# EAGLE schematic cdf-modular-bridge-rev3 (EAGLE 7.3.0)
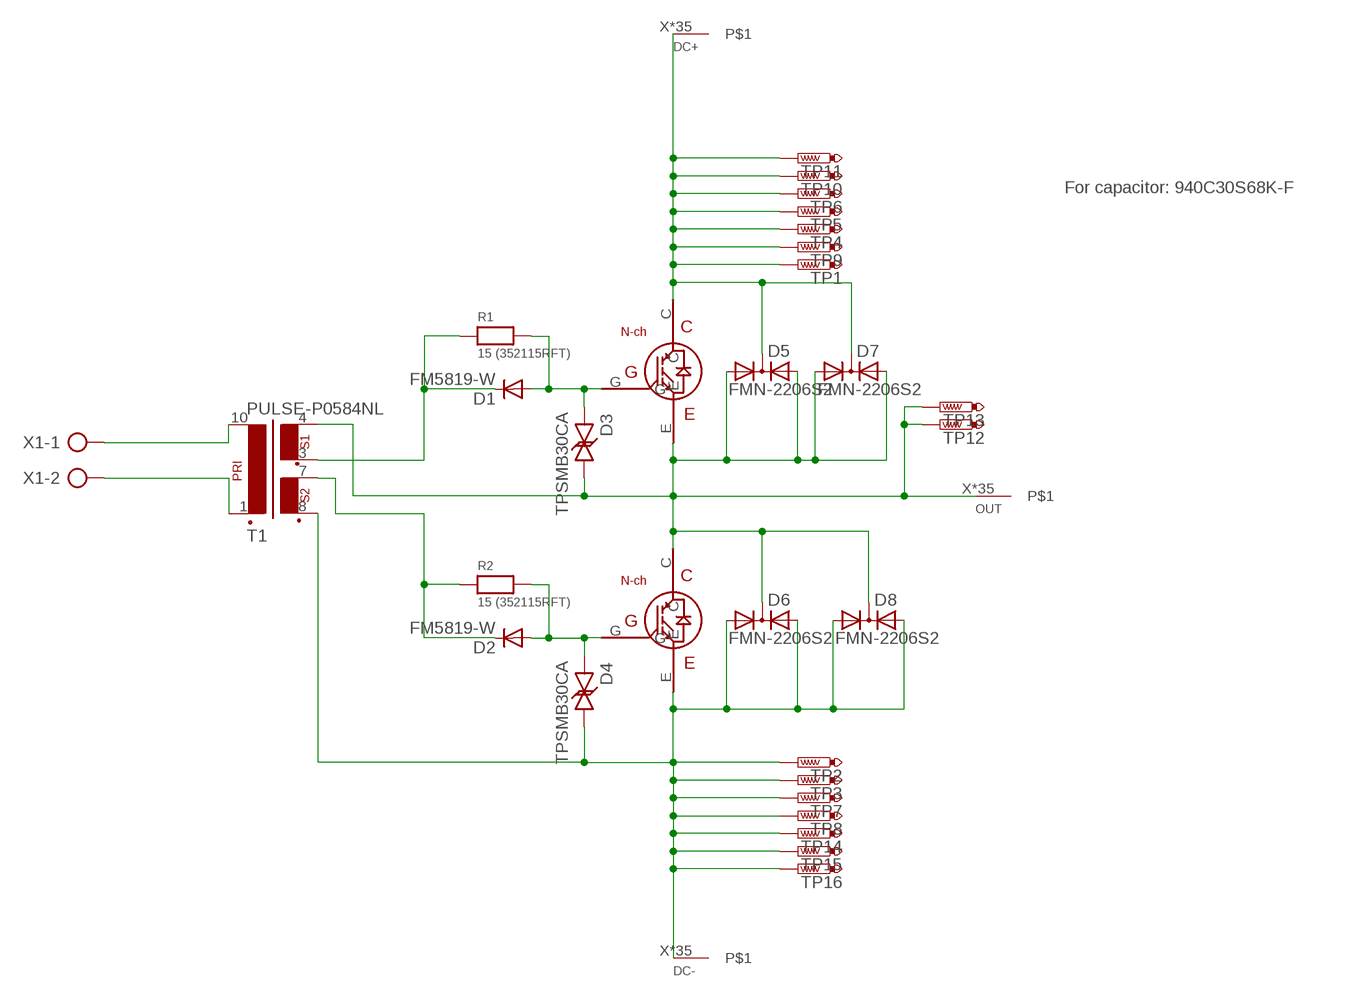
[diagram p0: schematic, sheet 1]

## Parts
D1  FM5819-W  S1A  [DO214AC]
D2  FM5819-W  S1A  [DO214AC]
D3  TPSMB30CA  TPSMB15CA  [TPSMB15CA]
D4  TPSMB30CA  TPSMB15CA  [TPSMB15CA]
D5  FMN-2206S2  [TO220-CDF-SPACED-LEGS]
D6  FMN-2206S2  [TO220-CDF-SPACED-LEGS]
D7  FMN-2206S2  [TO220-CDF-SPACED-LEGS]
D8  FMN-2206S2  [TO220-CDF-SPACED-LEGS]
DC+  BIG-ASS-HOLE  [BIG-ASS-HOLE]
DC-  BIG-ASS-HOLE  [BIG-ASS-HOLE]
OUT  BIG-ASS-HOLE  [BIG-ASS-HOLE]
Q1  Ixgh48n60a3  IXGH40N60A  [IXGH40N60A]
Q2  Ixgh48n60a3  IXGH40N60A  [IXGH40N60A]
R1  15 (352115RFT)  RESISTOR2512  [2512]
R2  15 (352115RFT)  RESISTOR2512  [2512]
T1  PULSE-P0584NL  [PULSE-P0584NL]
TP1  PTR1PAD1-17  [P1-17]
TP2  PTR1PAD1-17  [P1-17]
TP3  PTR1PAD1-17  [P1-17]
TP4  PTR1PAD1-17  [P1-17]
TP5  PTR1PAD1-17  [P1-17]
TP6  PTR1PAD1-17  [P1-17]
TP7  PTR1PAD1-17  [P1-17]
TP8  PTR1PAD1-17  [P1-17]
TP9  PTR1PAD1-17  [P1-17]
TP10  PTR1PAD1-17  [P1-17]
TP11  PTR1PAD1-17  [P1-17]
TP12  PTR1PAD1-17  [P1-17]
TP13  PTR1PAD1-17  [P1-17]
TP14  PTR1PAD1-17  [P1-17]
TP15  PTR1PAD1-17  [P1-17]
TP16  PTR1PAD1-17  [P1-17]
X1  AK500/2  [AK500/2]

## Nets
DC+: D5.C D7.C DC+.X DC+.X@1 DC+.X@2 DC+.X@3 DC+.X@4 DC+.X@5 DC+.X@6 DC+.X@7 DC+.X@8 DC+.X@9 DC+.X@10 DC+.X@11 DC+.X@12 DC+.X@13 DC+.X@14 DC+.X@15 DC+.X@16 DC+.X@17 DC+.X@18 DC+.X@19 DC+.X@20 DC+.X@21 DC+.X@22 DC+.X@23 DC+.X@24 DC+.X@25 DC+.X@26 DC+.X@27 DC+.X@28 DC+.X@29 DC+.X@30 DC+.X@31 DC+.X@32 DC+.X@34 DC+.X@120 Q1.C TP1.TP TP4.TP TP5.TP TP6.TP TP9.TP TP10.TP TP11.TP
DC-: D4.P$2 D6.A1 D6.A2 D8.A1 D8.A2 DC-.X DC-.X@1 DC-.X@2 DC-.X@3 DC-.X@4 DC-.X@5 DC-.X@6 DC-.X@7 DC-.X@8 DC-.X@9 DC-.X@10 DC-.X@11 DC-.X@12 DC-.X@13 DC-.X@14 DC-.X@15 DC-.X@16 DC-.X@17 DC-.X@18 DC-.X@19 DC-.X@20 DC-.X@21 DC-.X@22 DC-.X@23 DC-.X@24 DC-.X@25 DC-.X@26 DC-.X@27 DC-.X@28 DC-.X@29 DC-.X@30 DC-.X@31 DC-.X@32 DC-.X@34 DC-.X@120 Q2.E T1.8(SEC2_POS) TP2.TP TP3.TP TP7.TP TP8.TP TP14.TP TP15.TP TP16.TP
N$1: T1.10(PRI_NEG) X1.1
N$2: T1.1(PRI_POS) X1.2
N$3: D1.A D3.P$1 Q1.G R1.2
N$5: D2.A D4.P$1 Q2.G R2.2
N$7: D2.C R2.1 T1.7(SEC2_NEG)
N$8: D1.C R1.1 T1.3(SEC1_POS)
OUT: D3.P$2 D5.A1 D5.A2 D6.C D7.A1 D7.A2 D8.C OUT.X OUT.X@1 OUT.X@2 OUT.X@3 OUT.X@4 OUT.X@5 OUT.X@6 OUT.X@7 OUT.X@8 OUT.X@9 OUT.X@10 OUT.X@11 OUT.X@12 OUT.X@13 OUT.X@14 OUT.X@15 OUT.X@16 OUT.X@17 OUT.X@18 OUT.X@19 OUT.X@20 OUT.X@21 OUT.X@22 OUT.X@23 OUT.X@24 OUT.X@25 OUT.X@26 OUT.X@27 OUT.X@28 OUT.X@29 OUT.X@30 OUT.X@31 OUT.X@32 OUT.X@34 OUT.X@120 Q1.E Q2.C T1.4(SEC1_NEG) TP12.TP TP13.TP

## Notes on the sheet
- For capacitor: 940C30S68K-F

## Library data of the parts
D1 D2 = s1x_10:S1*: S1A - S1M General Purpose Rectifiers Source: http://www.fairchildsemi.com/datasheets/S1/S1A.pdf; MF: Fairchild; MPN: S1A; OC_FARNELL: 9843868; OC_NEWARK: 58K9551
D3 D4 = keves:TPSMB15CA
D5-D8 = keves:FMN-2206S
DC+ DC- OUT = keves:BIG-ASS-HOLE
Q1 Q2 = keves:IXGH40N60A
R1 R2 = microbuilder:RESISTOR: Resistors 0402 - 0402 Surface Mount Package 22 Ohm 1% 1/16W [Digikey: 311-22.0LRTR-ND] 33 Ohm 5% 1/16W 1.0K 5% 1/16W 1.5K 5% 1/16W 2.0K 1% 1/16W 10.0K 1% 1/16W [Digikey: 311-10.0KLRTR-ND] 10.0K 5% 1/16W [Digikey: RMCF0402JT10K0TR-ND] 12.1K 1% 1/16W [Digikey: 311-22.0LRTR-ND] 100.0K 5% 1/16W 0603 - 0603 Surface Mount Package 0 Ohm 1/10 Watt 1% Resistor 15 Ohm 1/10 Watt 1% Resistor 33 Ohm 1/10 Watt 1% Resistor 49.9 Ohm 1/10 Watt 1% Resistor 100 Ohm 1/10 Watt 1% Resistor 150 Ohm 1/10 Watt 1% Resistor 240 Ohm 1/10 Watt 1% Resistor 390 Ohm 1/10 Watt 1% Resistor 560 Ohm 1/10 Watt 1% Resistor 680 Ohm 1/10 Watt 1% Resistor 750 Ohm 1/10 Watt 1% Resistor 1.0K Ohm 1/10 Watt 1% Resistor 1.5K Ohm 1/10 Watt 1% Resistor 2.0K Ohm 1/10 Watt 1% Resistor 2.2K Ohm 1/10 Watt 1% Resistor 3.3K Ohm 1/10 Watt 1% Resistor 4.7K Ohm 1/10 Watt 1% Resistor 10.0K Ohm 1/10 Watt 1% Resistor 12.0K Ohm 1/10 Watt 1% Resistor 12.1K Ohm 1/10 Watt 1% Resistor 20.0K Ohm 1/10 Watt 1% Resistor 33.0K Ohm 1/10 Watt 1% Resistor 100.0K Ohm 1/10 Watt 1% Resistor 0805 - 0805 Surface Mount Package 0 Ohm 1/8 Watt 1% Resistor 33 Ohm 1/8 Watt 1% Resistor 100 Ohm 1/8 Watt 1% Resistor 150 Ohm 1/8 Watt 1% Resistor 200 Ohm 1/8 Watt 1% Resistor 240 Ohm 1/8 Watt 1% Resistor 330 Ohm 1/8 Watt 1% Resistor 390 Ohm 1/8 Watt 1% Resistor 470 Ohm 1/8 Watt 1% Resistor 1.0K Ohm 1/8 Watt 1% Resistor 1.5K Ohm 1/8 Watt 1% Resistor 2.0K Ohm 1/8 Watt 1% Resistor 4.7K Ohm 1/8 Watt 1% Resistor 5.1K Ohm 1/8 Watt 1% Resistor 5.6K Ohm 1/8 Watt 1% Resistor 10.0K Ohm 1/8 Watt 1% Resistor 22.0K Ohm 1/8 Watt 1% Resistor 33.0K Ohm 1/8 Watt 1% Resistor 100K Ohm 1/8 Watt 1% Resistor 1206 - 1206 Surface Mount Package 2012 - 2010 Surface Mount Package 0.11 Ohm 1/2 Watt 1% Resistor - Digikey: RHM.11UCT-ND
T1 = keves:PULSE-P0584NL
TP1-TP16 = testpad:PTR1: TEST PIN
X1 = con-ptr500:AK500/2: CONNECTOR; OC_FARNELL: unknown; OC_NEWARK: unknown